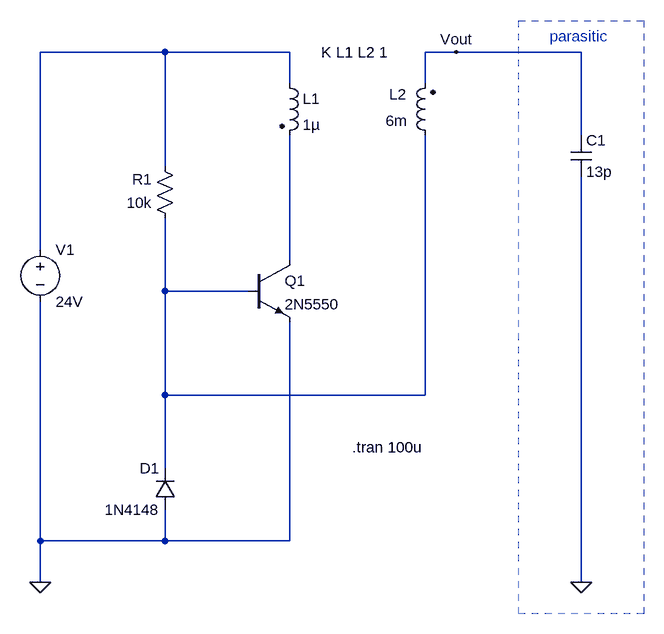
[diagram p0: schematic tesla_LC.asc]
tesla_LC.asc, the LTspice schematic file:
Version 4
SHEET 1 1516 1892
WIRE -432 -240 -624 -240
WIRE -240 -240 -432 -240
WIRE 16 -240 -32 -240
WIRE 208 -240 16 -240
WIRE -240 -192 -240 -240
WIRE -32 -192 -32 -240
WIRE 208 -112 208 -240
WIRE -432 -64 -432 -240
WIRE -624 64 -624 -240
WIRE -240 80 -240 -112
WIRE -432 128 -432 16
WIRE -304 128 -432 128
WIRE -432 288 -432 128
WIRE -32 288 -32 -112
WIRE -32 288 -432 288
WIRE -432 400 -432 288
WIRE -624 512 -624 144
WIRE -432 512 -432 464
WIRE -432 512 -624 512
WIRE -240 512 -240 176
WIRE -240 512 -432 512
WIRE -624 576 -624 512
WIRE 208 576 208 -48
FLAG -624 576 0
FLAG 208 576 0
FLAG 16 -240 Vout
SYMBOL ind2 -256 -208 R0
SYMATTR InstName L1
SYMATTR Value 1µ
SYMATTR Type ind
SYMBOL ind2 -16 -96 R180
WINDOW 0 44 79 Left 2
WINDOW 3 43 38 Left 2
SYMATTR InstName L2
SYMATTR Value 6m
SYMATTR Type ind
SYMBOL res -416 32 R180
WINDOW 0 36 76 Left 2
WINDOW 3 36 40 Left 2
SYMATTR InstName R1
SYMATTR Value 10k
SYMBOL npn -304 80 R0
SYMATTR InstName Q1
SYMATTR Value 2N5550
SYMBOL cap 192 -112 R0
SYMATTR InstName C1
SYMATTR Value 13p
SYMATTR SpiceLine V=19k
SYMBOL diode -416 464 R180
WINDOW 0 24 64 Left 2
WINDOW 3 24 0 Left 2
SYMATTR InstName D1
SYMATTR Value 1N4148
SYMATTR Description Light Emitting Diode
SYMATTR Type led
SYMBOL voltage -624 48 R0
WINDOW 123 0 0 Left 0
WINDOW 39 24 124 Left 2
SYMATTR InstName V1
SYMATTR Value 24V
TEXT -192 -240 Left 2 !K L1 L2 1
TEXT -144 368 Left 2 !.tran 100u
TEXT 160 -264 Left 2 ;parasitic
RECTANGLE Normal 304 624 112 -288 2

The netlist it stands for:
* tesla_LC.asc
L1 N001 N002 1µ
L2 N003 Vout 6m
R1 N003 N001 10k
Q1 N002 N003 0 0 2N5550
C1 Vout 0 13p V=19k
D1 0 N003 1N4148
V1 N001 0 24V
.model D D
.lib standard.dio
.model NPN NPN
.model PNP PNP
.lib standard.bjt
K L1 L2 1
.tran 100u
* parasitic
.backanno
.end